# Altium project ADCAN_21_22_Project.PrjPcb (part 3 of 3)

## Sheet [4] Signals.SchDoc
size A4; SheetNumber: 5; SheetTotal: 6
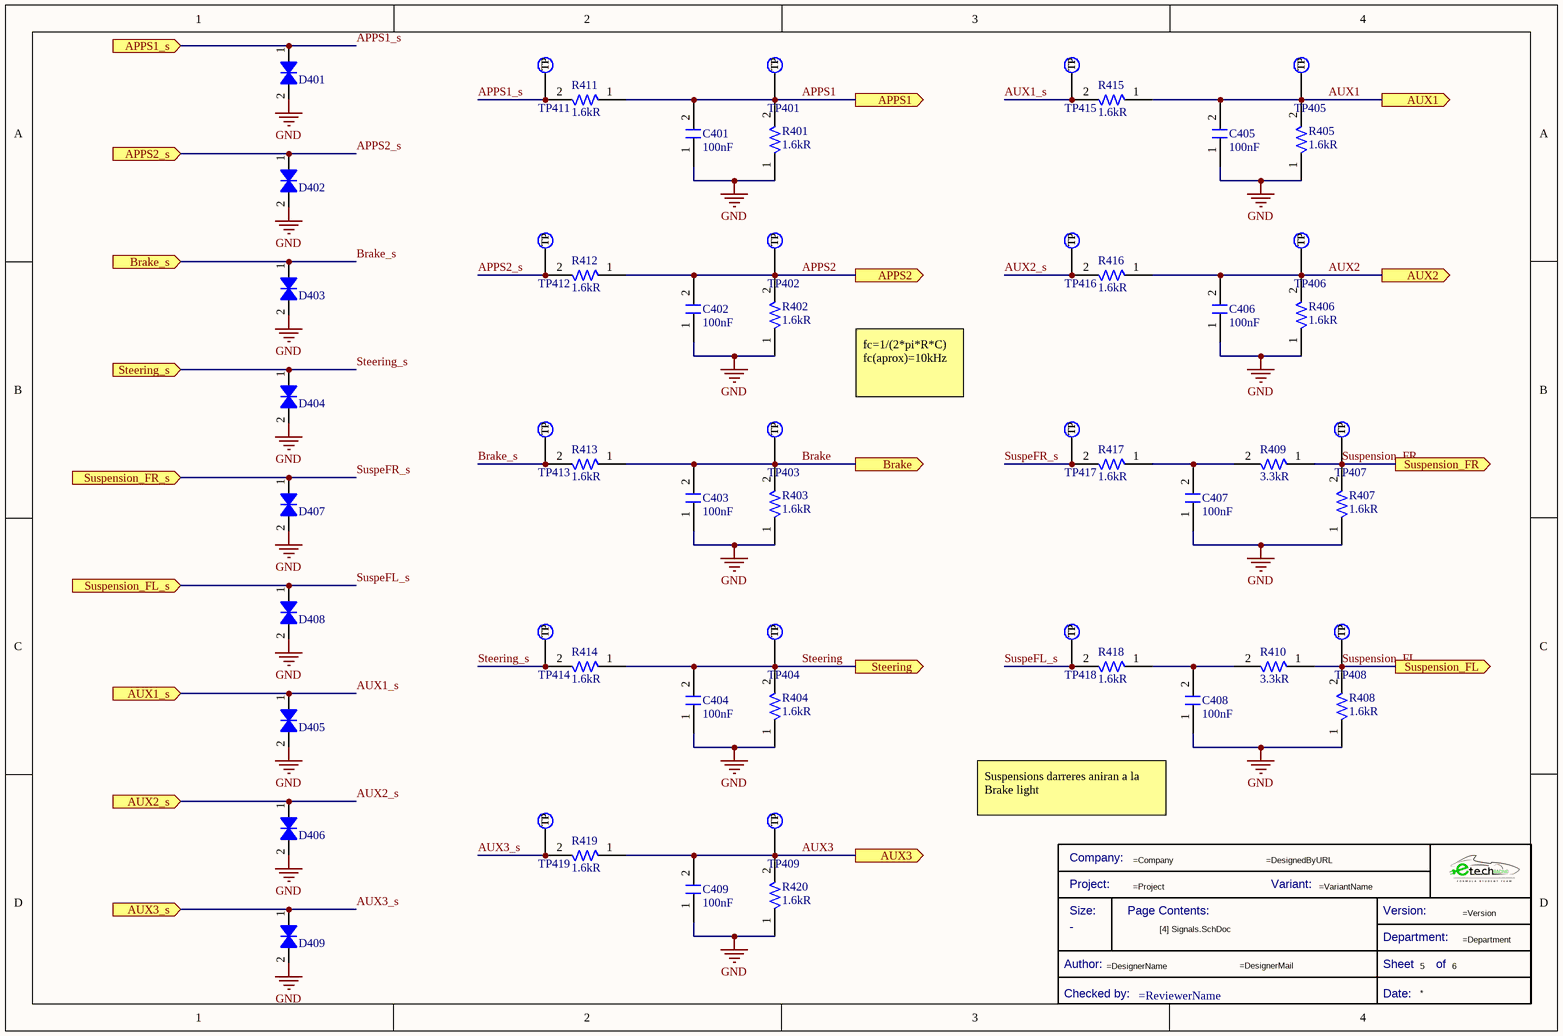
[diagram p4: [4] Signals.SchDoc]

### Parts
(Parts that share a designator on the sheet are numbered #1, #2 ... from top to bottom, then left to right.)
*#5  Title Block_template  (value not drawn)  (graphical)
C401  Capacitance: 100nF  [C1206FNPC-RW]  (hidden comment: 885012208009)
C402  Capacitance: 100nF  [C1206FNPC-RW]  (hidden comment: 885012208009)
C403  Capacitance: 100nF  [C1206FNPC-RW]  (hidden comment: 885012208009)
C404  Capacitance: 100nF  [C1206FNPC-RW]  (hidden comment: 885012208009)
C405  Capacitance: 100nF  [C1206FNPC-RW]  (hidden comment: 885012208009)
C406  Capacitance: 100nF  [C1206FNPC-RW]  (hidden comment: 885012208009)
C407  Capacitance: 100nF  [C1206FNPC-RW]  (hidden comment: 885012208009)
C408  Capacitance: 100nF  [C1206FNPC-RW]  (hidden comment: 885012208009)
C409  Capacitance: 100nF  [C1206FNPC-RW]  (hidden comment: 885012208009)
D401  824501600  [DTVS-DO-214AC]  (value not drawn)
D402  824501600  [DTVS-DO-214AC]  (value not drawn)
D403  824501600  [DTVS-DO-214AC]  (value not drawn)
D404  824501600  [DTVS-DO-214AC]  (value not drawn)
D405  824501600  [DTVS-DO-214AC]  (value not drawn)
D406  824501600  [DTVS-DO-214AC]  (value not drawn)
D407  824501600  [DTVS-DO-214AC]  (value not drawn)
D408  824501600  [DTVS-DO-214AC]  (value not drawn)
D409  824501600  [DTVS-DO-214AC]  (value not drawn)
R401  Resistance: 1.6kR  [R1206FTK-W]  (hidden comment: CRCW12061K60FKEA)
R402  Resistance: 1.6kR  [R1206FTK-W]  (hidden comment: CRCW12061K60FKEA)
R403  Resistance: 1.6kR  [R1206FTK-W]  (hidden comment: CRCW12061K60FKEA)
R404  Resistance: 1.6kR  [R1206FTK-W]  (hidden comment: CRCW12061K60FKEA)
R405  Resistance: 1.6kR  [R1206FTK-W]  (hidden comment: CRCW12061K60FKEA)
R406  Resistance: 1.6kR  [R1206FTK-W]  (hidden comment: CRCW12061K60FKEA)
R407  Resistance: 1.6kR  [R1206FTK-W]  (hidden comment: CRCW12064K30FKEA)
R408  Resistance: 1.6kR  [R1206FTK-W]  (hidden comment: CRCW12064K30FKEA)
R409  Resistance: 3.3kR  [R1206FTK-W]  (hidden comment: CRCW12066K19FKEA)
R410  Resistance: 3.3kR  [R1206FTK-W]  (hidden comment: CRCW12066K19FKEA)
R411  Resistance: 1.6kR  [R1206FTK-W]  (hidden comment: CRCW12061K60FKEA)
R412  Resistance: 1.6kR  [R1206FTK-W]  (hidden comment: CRCW12061K60FKEA)
R413  Resistance: 1.6kR  [R1206FTK-W]  (hidden comment: CRCW12061K60FKEA)
R414  Resistance: 1.6kR  [R1206FTK-W]  (hidden comment: CRCW12061K60FKEA)
R415  Resistance: 1.6kR  [R1206FTK-W]  (hidden comment: CRCW12061K60FKEA)
R416  Resistance: 1.6kR  [R1206FTK-W]  (hidden comment: CRCW12061K60FKEA)
R417  Resistance: 1.6kR  [R1206FTK-W]  (hidden comment: CRCW12061K60FKEA)
R418  Resistance: 1.6kR  [R1206FTK-W]  (hidden comment: CRCW12061K60FKEA)
R419  Resistance: 1.6kR  [R1206FTK-W]  (hidden comment: CRCW12061K60FKEA)
R420  Resistance: 1.6kR  [R1206FTK-W]  (hidden comment: CRCW12061K60FKEA)
TP401  TestPoint  [TestPoint]  (value not drawn)  (no BOM)
TP402  TestPoint  [TestPoint]  (value not drawn)  (no BOM)
TP403  TestPoint  [TestPoint]  (value not drawn)  (no BOM)
TP404  TestPoint  [TestPoint]  (value not drawn)  (no BOM)
TP405  TestPoint  [TestPoint]  (value not drawn)  (no BOM)
TP406  TestPoint  [TestPoint]  (value not drawn)  (no BOM)
TP407  TestPoint  [TestPoint]  (value not drawn)  (no BOM)
TP408  TestPoint  [TestPoint]  (value not drawn)  (no BOM)
TP409  TestPoint  [TestPoint]  (value not drawn)  (no BOM)
TP411  TestPoint  [TestPoint]  (value not drawn)  (no BOM)
TP412  TestPoint  [TestPoint]  (value not drawn)  (no BOM)
TP413  TestPoint  [TestPoint]  (value not drawn)  (no BOM)
TP414  TestPoint  [TestPoint]  (value not drawn)  (no BOM)
TP415  TestPoint  [TestPoint]  (value not drawn)  (no BOM)
TP416  TestPoint  [TestPoint]  (value not drawn)  (no BOM)
TP417  TestPoint  [TestPoint]  (value not drawn)  (no BOM)
TP418  TestPoint  [TestPoint]  (value not drawn)  (no BOM)
TP419  TestPoint  [TestPoint]  (value not drawn)  (no BOM)

### Ports
APPS1 (out), APPS1_s (in), APPS2 (out), APPS2_s (in), AUX1 (out), AUX1_s (in), AUX2 (out), AUX2_s (in), AUX3 (out), AUX3_s (in), Brake (out), Brake_s (in), Steering (out), Steering_s (in), Suspension_FL (out), Suspension_FL_s (in), Suspension_FR (out), Suspension_FR_s (in)

### Nets
GND: C401.1 C402.1 C403.1 C404.1 C405.1 C406.1 C407.1 C408.1 C409.1 D401.2 D402.2 D403.2 D404.2 D405.2 D406.2 D407.2 D408.2 D409.2 R401.1 R402.1 R403.1 R404.1 R405.1 R406.1 R407.1 R408.1 R420.1
APPS1: C401.2 R401.2 R411.1 TP401.1(TP) ; port APPS1
APPS1_s: D401.1 R411.2 TP411.1(TP) ; port APPS1_s
APPS2: C402.2 R402.2 R412.1 TP402.1(TP) ; port APPS2
APPS2_s: D402.1 R412.2 TP412.1(TP) ; port APPS2_s
AUX1: C405.2 R405.2 R415.1 TP405.1(TP) ; port AUX1
AUX1_s: D405.1 R415.2 TP415.1(TP) ; port AUX1_s
AUX2: C406.2 R406.2 R416.1 TP406.1(TP) ; port AUX2
AUX2_s: D406.1 R416.2 TP416.1(TP) ; port AUX2_s
AUX3: C409.2 R419.1 R420.2 TP409.1(TP) ; port AUX3
AUX3_s: D409.1 R419.2 TP419.1(TP) ; port AUX3_s
Brake: C403.2 R403.2 R413.1 TP403.1(TP) ; port Brake
Brake_s: D403.1 R413.2 TP413.1(TP) ; port Brake_s
Steering: C404.2 R404.2 R414.1 TP404.1(TP) ; port Steering
Steering_s: D404.1 R414.2 TP414.1(TP) ; port Steering_s
SuspeFL_s: D408.1 R418.2 TP418.1(TP) ; port Suspension_FL_s
SuspeFR_s: D407.1 R417.2 TP417.1(TP) ; port Suspension_FR_s
Suspension_FL: R408.2 R410.1 TP408.1(TP) ; port Suspension_FL
Suspension_FR: R407.2 R409.1 TP407.1(TP) ; port Suspension_FR
NetC407_2: C407.2 R409.2 R417.1
NetC408_2: C408.2 R410.2 R418.1

### Notes on the sheet
- fc=1/(2*pi*R*C)
  fc(aprox)=10kHz
- Suspensions darreres aniran a la Brake light
- (in symbol Title Block_template) Company:; Project:; Variant:; Size:; Page Contents:; Version:; Department:; Author:; Sheet; of; Checked by:; Date:

### Library data of the parts
*#5 = Title Block_template: Standard Title Block; .Creator: GP; Category: Title Block; .PCBcheck: GP; .SCHcheck: GP; Checked by:: =ReviewerName; Size: -
C401-C409 = C100n-10V-1206FNPC-X7R: Cap, 0.1ΜF, 10V, 10%, X7R, 1206; Manufacturer 1: Wurth Electronics; Supplier 1: Digi-Key; Manufacturer Part Number 1: 885012208009; RoHS: Yes; Category: Ceramic Capacitors; Stock 1: 7198; Pricing 1: 1=0,11000, 10=0,10300, 100=0,09200, 500=0,08100 (USD); Mount: Surface Mount; Case/Package: 1206; Case Code (Metric): 3216; Case Code (Imperial): 1206; Min Operating Temperature: -55°C; Max Operating Temperature: 125°C; Packaging: Tape and Reel; Voltage Rating: 10V; Tolerance: 10%; Length: 0.126inch; Width: 0.063inch; Thickness: 0.035inch; RoHS Compliant: Yes; ComponentLink1URL: http://www.farnell.com/datasheets/2031891.pdf?src-supplier=Farnell; ComponentLink1Description: http://www.farnell.com/datasheets/2031891.pdf?src-supplier=Farnell; ComponentLink2URL: http://katalog.we-online.de/pbs/datasheet/885012208009.pdf?src-supplier=Digi-Key; ComponentLink2Description: http://katalog.we-online.de/pbs/datasheet/885012208009.pdf?src-supplier=Digi-Key; ComponentLink3URL: https://katalog.we-online.de/pbs/datasheet/885012208009.pdf?src-supplier=Digi-Key; ComponentLink3Description: https://katalog.we-online.de/pbs/datasheet/885012208009.pdf?src-supplier=Digi-Key; Supplier Part Number 1: 732-8086-1-ND; ComponentLink4Description: Wurth Elektronik; ComponentLink4URL: https://www.we-online.com/catalog/en/WCAP-CSGP-10VDC?sq=885012208009#885012208009
D401-D409 = DTVS-6V-DO-214AC: TVS diode [Würth Elektronik] 824501600 TVS diode; Manufacturer: Wurth Electronics; Number of Bidirectional Channels: 1; Reverse Standoff Voltage: 6V; Min Breakdown Voltage: 7.02V; Clamping Voltage: 10.3V; Peak Pulse Power: 400W; Power Line Protection: No; Polarity: Bidirectional; Peak Pulse Current: 38.8A; ComponentLink1Description: Where buy it; ComponentLink1URL: https://www.we-online.com/catalog/en/WE-TVSP?sq=824501600#824501600; Supplier 1: Mouser; Manufacturer Part Number: 824501600; RoHS: Yes; Category: TVS Diodes; Stock 1: 780; Pricing 1: 1=0,28000, 10=0,26100, 50=0,26100, 100=0,23400, 500=0,20400, 1000=0,17400, 10000=0,17400 (USD); Mount: Surface Mount; Number of Pins: 2; Min Operating Temperature: -65°C; Max Operating Temperature: 150°C; Packaging: Cut Tape; Max Breakdown Voltage: 7.02V; Resistor Type: Zener; REACH SVHC: Unknown; RoHS Compliant: Yes; ComponentLink2URL: http://www.farnell.com/datasheets/2036401.pdf?src-supplier=Element14; ComponentLink2Description: http://www.farnell.com/datasheets/2036401.pdf?src-supplier=Element14; Supplier Part Number 1: 710-824501600; ComponentLink3URL: https://katalog.we-online.de/pbs/datasheet/824501600.pdf?src-supplier=Digi-Key; ComponentLink3Description: https://katalog.we-online.de/pbs/datasheet/824501600.pdf?src-supplier=Digi-Key
R401-R406 R411-R420 = R1.6K-1206FTK: Res Thick Film 1206 1.6K Ohm 1% 1/4W ±100ppm/°C Molded SMD SMD Paper T/R; Manufacturer 1: Vishay; Max Power Dissipation: 250mW; Voltage Rating: 200V; Supplier 1: Digi-Key; Manufacturer Part Number 1: CRCW12061K60FKEA; RoHS: Yes; Category: Chip SMD Resistors; Pricing 1: 1=0,10000, 10=0,08200, 100=0,03160, 1000=0,01392, 2500=0,01202 (USD); Case/Package: 1206; Number of Pins: 2; Contact Plating: Tin; Case Code (Metric): 3216; Case Code (Imperial): 1206; Weight: 0.000353oz; Size Code: 1206; Min Operating Temperature: -55°C; Max Operating Temperature: 155°C; Tolerance: 1%; Resistor Type: Thick Film; Temperature Coefficient: 100ppm/°C; Package Quantity: 5000; Packaging: Tape and Reel; Number of Terminations: 2; Features: Automotive AEC-Q200; Series: CRCW; Power Rating: 250mW; Termination: SMD/SMT; Voltage Rating (DC): 200V; Resistance Tolerance: 1%; Technology: THICK FILM; Construction: Rectangular; Length: 3.2mm; Width: 0.063inch; Height: 0.55mm; Depth: 1.6mm; Radiation Hardening: No; Lead Free: Lead Free; RoHS Compliant: Yes; REACH SVHC: Unknown; Military Standard: Not; ComponentLink1URL: https://datasheet.ciiva.com/11811/0900766b80d98b5e-11811377.pdf?src-supplier=RSComponents; ComponentLink1Description: https://datasheet.ciiva.com/11811/0900766b80d98b5e-11811377.pdf?src-supplier=RSComponents; ComponentLink2URL: https://datasheet.ciiva.com/2515/dcrcwe3-2515616.pdf?src-supplier=Digi-Key; ComponentLink2Description: https://datasheet.ciiva.com/2515/dcrcwe3-2515616.pdf?src-supplier=Digi-Key; ComponentLink3URL: https://datasheet.ciiva.com/2515/dcrcwe3-2515617.pdf?src-supplier=Digi-Key; ComponentLink3Description: https://datasheet.ciiva.com/2515/dcrcwe3-2515617.pdf?src-supplier=Digi-Key; ComponentLink4URL: https://datasheet.ciiva.com/2515/dcrcwe3-2515618.pdf?src-supplier=Digi-Key; ComponentLink4Description: https://datasheet.ciiva.com/2515/dcrcwe3-2515618.pdf?src-supplier=Digi-Key; ComponentLink5URL: https://datasheet.ciiva.com/9098/dcrcwe3-9098889.pdf?src-supplier=Avnet; ComponentLink5Description: https://datasheet.ciiva.com/9098/dcrcwe3-9098889.pdf?src-supplier=Avnet; ComponentLink6URL: https://datasheet.ciiva.com/16213/dcrcwe3-16213498.pdf?src-supplier=Future+Electronics; ComponentLink6Description: https://datasheet.ciiva.com/16213/dcrcwe3-16213498.pdf?src-supplier=Future+Electronics; ComponentLink7URL: https://datasheet.ciiva.com/17203/dcrcwe3-17203786.pdf?src-supplier=Avnet+Europe; ComponentLink7Description: https://datasheet.ciiva.com/17203/dcrcwe3-17203786.pdf?src-supplier=Avnet+Europe; ComponentLink8URL: https://datasheet.ciiva.com/7670/1697337-7670316.pdf?src-supplier=Element14; ComponentLink8Description: https://datasheet.ciiva.com/7670/1697337-7670316.pdf?src-supplier=Element14; ComponentLink9URL: https://datasheet.ciiva.com/7670/1697337-7670317.pdf?src-supplier=Element14; ComponentLink9Description: https://datasheet.ciiva.com/7670/1697337-7670317.pdf?src-supplier=Element14; ComponentLink10URL: https://datasheet.ciiva.com/5550/dcrcwe3-109170-5550718.pdf?src-supplier=Mouser; ComponentLink10Description: https://datasheet.ciiva.com/5550/dcrcwe3-109170-5550718.pdf?src-supplier=Mouser; Supplier Part Number 1: 541-1.60KFCT-ND; ComponentLink11Description: RS; ComponentLink11URL: https://es.rs-online.com/web/p/resistencias-fijas-para-montaje-en-superficie/6791866/
R407 R408 = R4.3K-1206FTK: Res Thick Film 1206 4.3K Ohm 1% 1/4W ±100ppm/°C Molded SMD SMD Paper T/R; Manufacturer 1: Vishay; Power Rating: 250mW; Voltage Rating: 200V; Supplier 1: Digi-Key; Manufacturer Part Number 1: CRCW12064K30FKEA; RoHS: Yes; Category: Chip SMD Resistors; Pricing 1: 1=0,10000, 10=0,08200, 100=0,03160, 1000=0,01392, 2500=0,01202 (USD); Case/Package: 1206; Number of Pins: 2; Contact Plating: Tin; Weight: 0.000353oz; Case Code (Metric): 3216; Case Code (Imperial): 1206; Min Operating Temperature: -55°C; Max Operating Temperature: 155°C; Tolerance: 1%; Resistor Type: Thick Film; Temperature Coefficient: 100ppm/°C; Packaging: Tape and Reel; Number of Terminations: 2; Termination: SMD/SMT; Max Power Dissipation: 250mW; Features: Automotive AEC-Q200; Series: CRCW; Package Quantity: 10; Voltage Rating (DC): 200V; Resistance Tolerance: 1%; Construction: Rectangular; Technology: THICK FILM; Length: 3.2mm; Width: 0.063inch; Height: 0.55mm; Depth: 1.6mm; Radiation Hardening: No; Lead Free: Lead Free; RoHS Compliant: Yes; REACH SVHC: Unknown; Military Standard: Not; ComponentLink1URL: https://datasheet.ciiva.com/11811/0900766b80d98b5e-11811783.pdf?src-supplier=RSComponents; ComponentLink1Description: https://datasheet.ciiva.com/11811/0900766b80d98b5e-11811783.pdf?src-supplier=RSComponents; ComponentLink2URL: https://datasheet.ciiva.com/2497/dcrcwe3-2497360.pdf?src-supplier=Digi-Key; ComponentLink2Description: https://datasheet.ciiva.com/2497/dcrcwe3-2497360.pdf?src-supplier=Digi-Key; ComponentLink3URL: https://datasheet.ciiva.com/2497/dcrcwe3-2497361.pdf?src-supplier=Digi-Key; ComponentLink3Description: https://datasheet.ciiva.com/2497/dcrcwe3-2497361.pdf?src-supplier=Digi-Key; ComponentLink4URL: https://datasheet.ciiva.com/2497/dcrcwe3-2497362.pdf?src-supplier=Digi-Key; ComponentLink4Description: https://datasheet.ciiva.com/2497/dcrcwe3-2497362.pdf?src-supplier=Digi-Key; ComponentLink5URL: https://datasheet.ciiva.com/7679/1533075-7679286.pdf?src-supplier=Element14; ComponentLink5Description: https://datasheet.ciiva.com/7679/1533075-7679286.pdf?src-supplier=Element14; ComponentLink6URL: https://datasheet.ciiva.com/5562/dcrcwe3-109170-5562219.pdf?src-supplier=Mouser; ComponentLink6Description: https://datasheet.ciiva.com/5562/dcrcwe3-109170-5562219.pdf?src-supplier=Mouser; ComponentLink7URL: https://datasheet.ciiva.com/17196/dcrcwe3-17196843.pdf?src-supplier=Avnet+Europe; ComponentLink7Description: https://datasheet.ciiva.com/17196/dcrcwe3-17196843.pdf?src-supplier=Avnet+Europe; ComponentLink8URL: https://datasheet.ciiva.com/7679/1697337-7679213.pdf?src-supplier=Element14; ComponentLink8Description: https://datasheet.ciiva.com/7679/1697337-7679213.pdf?src-supplier=Element14; ComponentLink9URL: https://datasheet.ciiva.com/9073/dcrcwe3-9073935.pdf?src-supplier=Avnet; ComponentLink9Description: https://datasheet.ciiva.com/9073/dcrcwe3-9073935.pdf?src-supplier=Avnet; Supplier Part Number 1: 541-4.30KFCT-ND; ComponentLink10Description: RS; ComponentLink10URL: https://es.rs-online.com/web/p/resistencias-fijas-para-montaje-en-superficie/6792187/
R409 R410 = R6.2K-1206FTK: Res Thick Film 1206 6.19K Ohm 1% 1/4W ±100ppm/°C Molded SMD SMD Paper T/R; Manufacturer 1: Vishay; Power Rating: 250mW; Voltage Rating: 200V; Supplier 1: Digi-Key; Manufacturer Part Number 1: CRCW12066K19FKEA; RoHS: Yes; Category: Chip SMD Resistors; Stock 1: 66; Pricing 1: 1=0,10000, 10=0,08200, 100=0,03160, 1000=0,01392, 2500=0,01202 (USD); Case/Package: 1206; Contact Plating: Tin; Weight: 0.000353oz; Case Code (Imperial): 1206; Case Code (Metric): 3216; Min Operating Temperature: -55°C; Max Operating Temperature: 155°C; Tolerance: 1%; Temperature Coefficient: 100ppm/°C; Packaging: Tape and Reel; Resistor Type: Thick Film; Number of Terminations: 2; Max Power Dissipation: 250mW; Features: Automotive AEC-Q200; Series: CRCW; Package Quantity: 10; Termination: SMD/SMT; Voltage Rating (DC): 200V; Resistance Tolerance: 1%; Technology: THICK FILM; Construction: Rectangular; Length: 3.2mm; Width: 1.6mm; Height: 0.55mm; Depth: 1.6mm; Radiation Hardening: No; Lead Free: Lead Free; RoHS Compliant: Yes; REACH SVHC: Unknown; Military Standard: Not; ComponentLink1URL: https://datasheet.ciiva.com/11818/0900766b80d98b5e-11818251.pdf?src-supplier=RSComponents; ComponentLink1Description: https://datasheet.ciiva.com/11818/0900766b80d98b5e-11818251.pdf?src-supplier=RSComponents; ComponentLink2URL: https://datasheet.ciiva.com/17193/dcrcwe3-17193575.pdf?src-supplier=Avnet+Europe; ComponentLink2Description: https://datasheet.ciiva.com/17193/dcrcwe3-17193575.pdf?src-supplier=Avnet+Europe; ComponentLink3URL: https://datasheet.ciiva.com/2496/dcrcwe3-2496955.pdf?src-supplier=Digi-Key; ComponentLink3Description: https://datasheet.ciiva.com/2496/dcrcwe3-2496955.pdf?src-supplier=Digi-Key; ComponentLink4URL: https://datasheet.ciiva.com/2496/dcrcwe3-2496956.pdf?src-supplier=Digi-Key; ComponentLink4Description: https://datasheet.ciiva.com/2496/dcrcwe3-2496956.pdf?src-supplier=Digi-Key; ComponentLink5URL: https://datasheet.ciiva.com/16201/dcrcwe3-16201468.pdf?src-supplier=Future+Electronics; ComponentLink5Description: https://datasheet.ciiva.com/16201/dcrcwe3-16201468.pdf?src-supplier=Future+Electronics; ComponentLink6URL: https://datasheet.ciiva.com/2496/dcrcwe3-2496957.pdf?src-supplier=Digi-Key; ComponentLink6Description: https://datasheet.ciiva.com/2496/dcrcwe3-2496957.pdf?src-supplier=Digi-Key; Supplier Part Number 1: 541-6.19KFCT-ND; ComponentLink7Description: RS; ComponentLink7URL: https://es.rs-online.com/web/p/resistencias-fijas-para-montaje-en-superficie/6792291/
TP401-TP409 TP411-TP419 = TestPoint: Test Point 1x1 mm; Category: TestPoint

## Sheet [5] Accelerometer.SchDoc
size A4; SheetNumber: 6; SheetTotal: 6
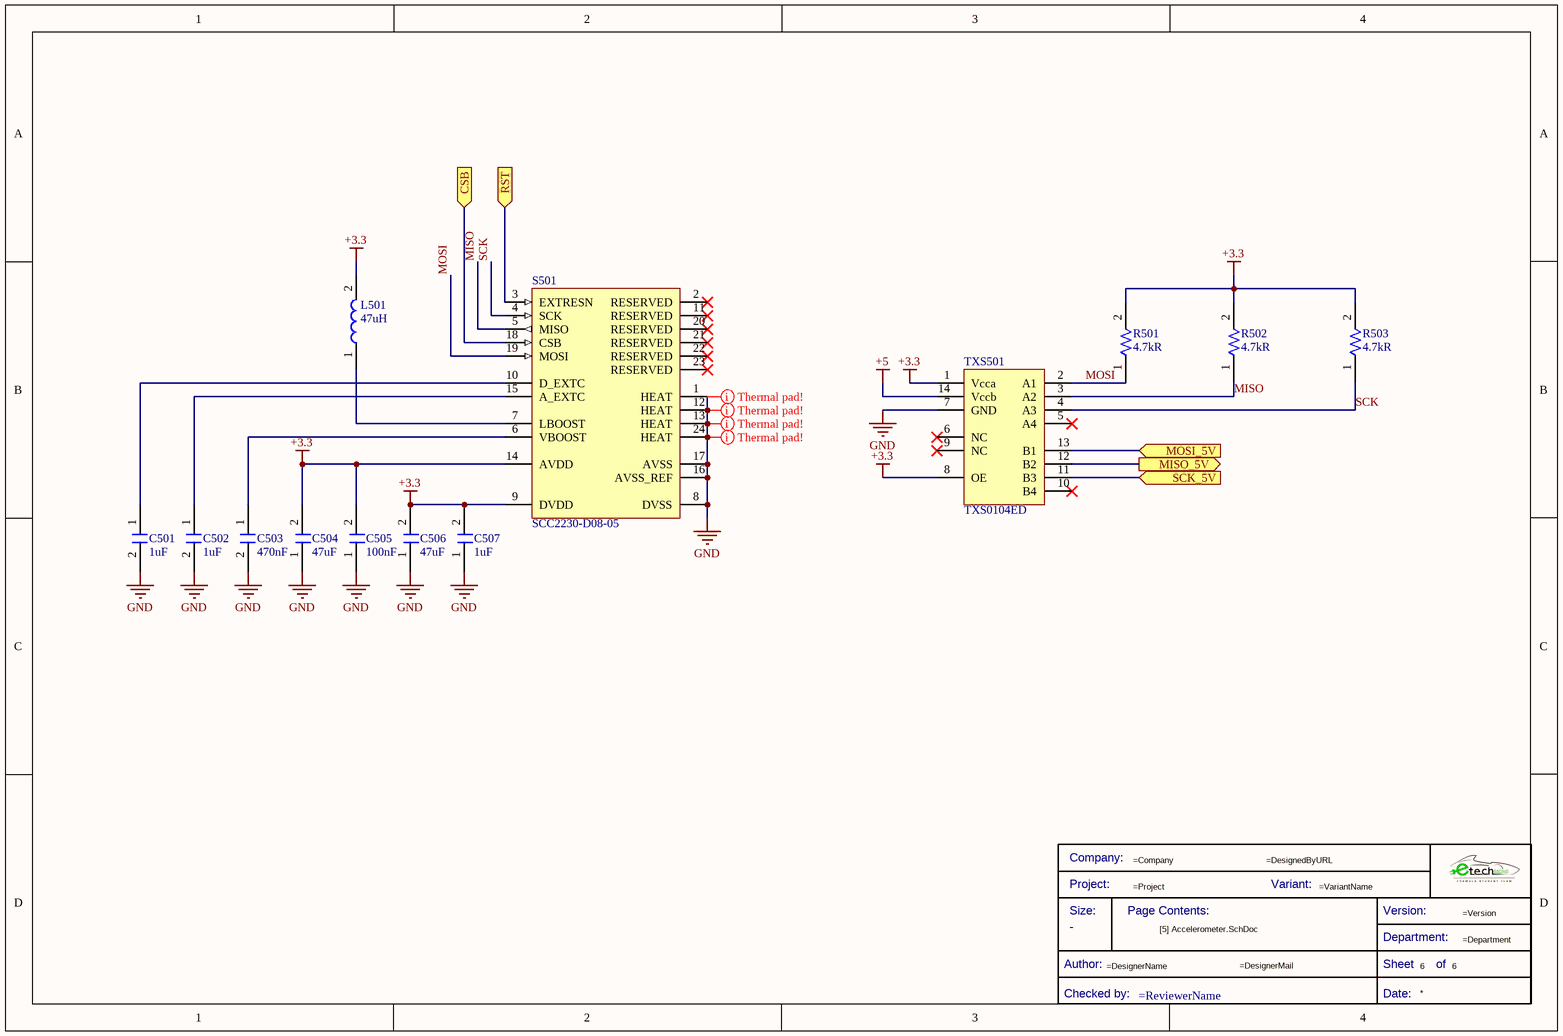
[diagram p5: [5] Accelerometer.SchDoc]

### Parts
(Parts that share a designator on the sheet are numbered #1, #2 ... from top to bottom, then left to right.)
*#6  Title Block_template  (value not drawn)  (graphical)
C501  Capacitance: 1uF  [C1206FNPC-RW]  (hidden comment: 885012208036)
C502  Capacitance: 1uF  [C1206FNPC-RW]  (hidden comment: 885012208036)
C503  Capacitance: 470nF  [C1206FNPC-RW]  (hidden comment: 885012208011)
C504  Capacitance: 47uF  [C1206FNPC-RW]  (hidden comment: 885012108012)
C505  Capacitance: 100nF  [C1206FNPC-RW]  (hidden comment: 885012208009)
C506  Capacitance: 47uF  [C1206FNPC-RW]  (hidden comment: 885012108012)
C507  Capacitance: 1uF  [C1206FNPC-RW]  (hidden comment: 885012208036)
L501  Inductance: 47uH  [L47u-60mA_CF]  (hidden comment: 744764147)
R501  Resistance: 4.7kR  [R1206FTK-W]  (hidden comment: CRS1206-FX-4701ELF)
R502  Resistance: 4.7kR  [R1206FTK-W]  (hidden comment: CRS1206-FX-4701ELF)
R503  Resistance: 4.7kR  [R1206FTK-W]  (hidden comment: CRS1206-FX-4701ELF)
S501  Manufacturer Part Number 1: SCC2230-D08-05  [Accel_SCC2230-D08]  (hidden comment: SCC2230-D08)
TXS501  Manufacturer Part Number 1: TXS0104ED  [4bitBVL_TXS0104E]  (hidden comment: TXS0104E)

### Ports
CSB (in), MISO_5V (out), MOSI_5V (in), RST (in), SCK_5V (in)

### Nets
+3.3: C504.2 C505.2 C506.2 C507.2 L501.2 R501.2 R502.2 R503.2 S501.9(DVDD) S501.14(AVDD) TXS501.1(Vcca) TXS501.8(OE)
+5: TXS501.14(Vccb)
GND: C501.2 C502.2 C503.2 C504.1 C505.1 C506.1 C507.1 S501.1(HEAT) S501.8(DVSS) S501.12(HEAT) S501.13(HEAT) S501.16(AVSS_REF) S501.17(AVSS) S501.24(HEAT) TXS501.7(GND)
CSB: S501.18(CSB) ; port CSB
MISO: R502.1 S501.5(MISO) TXS501.3(A2)
MISO_5V: TXS501.12(B2) ; port MISO_5V
MOSI: R501.1 S501.19(MOSI) TXS501.2(A1)
MOSI_5V: TXS501.13(B1) ; port MOSI_5V
RST: S501.3(EXTRESN) ; port RST
SCK: R503.1 S501.4(SCK) TXS501.4(A3)
SCK_5V: TXS501.11(B3) ; port SCK_5V
NetC501_1: C501.1 S501.10(D_EXTC)
NetC502_1: C502.1 S501.15(A_EXTC)
NetC503_1: C503.1 S501.6(VBOOST)
NetL501_1: L501.1 S501.7(LBOOST)

Not connected (* = marked no-connect by the designer): S501 2(RESERVED)* 11(RESERVED)* 20(RESERVED)* 21(RESERVED)* 22(RESERVED)* 23(RESERVED)*; TXS501 5(A4)* 6(NC)* 9(NC)* 10(B4)*

### Layout directives
mark named Thermal pad!: GND

### Notes on the sheet
- (in symbol Title Block_template) Company:; Project:; Variant:; Size:; Page Contents:; Version:; Department:; Author:; Sheet; of; Checked by:; Date:

### Library data of the parts
*#6 = Title Block_template: Standard Title Block; .Creator: GP; Category: Title Block; .PCBcheck: GP; .SCHcheck: GP; Checked by:: =ReviewerName; Size: -
C501 C502 C507 = C1u-16V-1206FNPC-X7R: Cap Cer 1UF 16V X7R 1206; Manufacturer: Wurth Electronics; Tolerance: 10%; Category: Capacitor; ComponentLink1Description: Datasheet; ComponentLink1URL: https://www.we-online.com/catalog/datasheet/885012208036.pdf; ComponentLink2Description: Where buy it; ComponentLink2URL: https://www.we-online.com/catalog/en/WCAP-CSGP-16VDC#885012208036; Supplier 1: Mouser; Manufacturer Part Number: 885012208036; RoHS: Yes; Stock 1: 5938; Pricing 1: 1=0,15000, 10=0,13900, 50=0,13900, 100=0,12400, 500=0,11000, 1000=0,11000, 3000=0,09100, 10000=0,09100 (USD); Mount: Surface Mount; Case/Package: 1206; Case Code (Metric): 3216; Case Code (Imperial): 1206; Min Operating Temperature: -55°C; Max Operating Temperature: 125°C; Packaging: Tape and Reel; Voltage Rating: 16V; Length: 0.126inch; Width: 0.063inch; Thickness: 0.051inch; RoHS Compliant: Yes; Supplier Part Number 1: 710-885012208036
C503 = C470n-10V-1206FNPC-X7R: Cap, 0.47ΜF, 10V, 10%, X7R, 1206; Manufacturer 1: Wurth Electronics; Supplier 1: Digi-Key; Manufacturer Part Number 1: 885012208011; RoHS: Yes; Category: Ceramic Capacitors; Stock 1: 1142; Pricing 1: 1=0,20000, 10=0,17700, 100=0,15900, 500=0,14000 (USD); Mount: Surface Mount; Case/Package: 1206; Case Code (Metric): 3216; Case Code (Imperial): 1206; Min Operating Temperature: -55°C; Max Operating Temperature: 125°C; Packaging: Tape and Reel; Voltage Rating: 10V; Tolerance: 10%; Length: 0.126inch; Width: 0.063inch; Thickness: 0.051inch; RoHS Compliant: Yes; ComponentLink1URL: http://www.farnell.com/datasheets/2546926.pdf?src-supplier=Farnell; ComponentLink1Description: http://www.farnell.com/datasheets/2546926.pdf?src-supplier=Farnell; ComponentLink2URL: https://katalog.we-online.de/pbs/datasheet/885012208011.pdf?src-supplier=Digi-Key; ComponentLink2Description: https://katalog.we-online.de/pbs/datasheet/885012208011.pdf?src-supplier=Digi-Key; Supplier Part Number 1: 732-7683-1-ND; ComponentLink3Description: Wurth Elektronik; ComponentLink3URL: https://www.we-online.com/catalog/en/WCAP-CSGP-10VDC?sq=885012208011#885012208011
C504 C506 = C47u-10V-1206FNPC-X5R: Multilayer Ceramic Capacitor, Wcap-Csgp Series, 47 F, 20%, X5r, 10 V, 1206 [3216 Metric]; Manufacturer 1: Wurth Electronics; Voltage Rating: 10V; Supplier 1: Digi-Key; Manufacturer Part Number 1: 885012108012; RoHS: Yes; Category: Ceramic Capacitors; Stock 1: 2003; Pricing 1: 1=1,26000, 10=1,14000, 100=1,02200, 500=0,90400 (USD); Mount: Surface Mount; Case/Package: 1206; Case Code (Metric): 3216; Case Code (Imperial): 1206; Min Operating Temperature: -55°C; Max Operating Temperature: 85°C; Packaging: Cut Tape; Dielectric: X5R; Tolerance: 20%; Voltage Rating (DC): 10V; Length: 0.126inch; Width: 0.063inch; Thickness: 0.075inch; REACH SVHC: Unknown; RoHS Compliant: Yes; ComponentLink1URL: http://www.farnell.com/datasheets/1958457.pdf?src-supplier=Farnell; ComponentLink1Description: http://www.farnell.com/datasheets/1958457.pdf?src-supplier=Farnell; ComponentLink2URL: https://katalog.we-online.de/pbs/datasheet/885012108012.pdf?src-supplier=Digi-Key; ComponentLink2Description: https://katalog.we-online.de/pbs/datasheet/885012108012.pdf?src-supplier=Digi-Key; ComponentLink3URL: http://www.farnell.com/datasheets/1958457.pdf?src-supplier=Element14; ComponentLink3Description: http://www.farnell.com/datasheets/1958457.pdf?src-supplier=Element14; Supplier Part Number 1: 732-7638-1-ND; ComponentLink4Description: Wurth Elektronik; ComponentLink4URL: https://www.we-online.com/catalog/en/WCAP-CSGP-10VDC?sq=885012108012#885012108012
C505 = C100n-10V-1206FNPC-X7R: as C401 on sheet [4] Signals; Supplier 1: Digi-Key; Manufacturer Part Number 1: 885012208009; RoHS: Yes; Category: Ceramic Capacitors; Stock 1: 7198; Pricing 1: 1=0,11000, 10=0,10300, 100=0,09200, 500=0,08100 (USD); Mount: Surface Mount; Case/Package: 1206; Case Code (Metric): 3216; Case Code (Imperial): 1206; Min Operating Temperature: -55°C; Max Operating Temperature: 125°C; Packaging: Tape and Reel; Voltage Rating: 10V; Tolerance: 10%; Length: 0.126inch; Width: 0.063inch; Thickness: 0.035inch; RoHS Compliant: Yes; ComponentLink1URL: http://www.farnell.com/datasheets/2031891.pdf?src-supplier=Farnell; ComponentLink1Description: http://www.farnell.com/datasheets/2031891.pdf?src-supplier=Farnell; ComponentLink2URL: http://katalog.we-online.de/pbs/datasheet/885012208009.pdf?src-supplier=Digi-Key; ComponentLink2Description: http://katalog.we-online.de/pbs/datasheet/885012208009.pdf?src-supplier=Digi-Key; ComponentLink3URL: https://katalog.we-online.de/pbs/datasheet/885012208009.pdf?src-supplier=Digi-Key; ComponentLink3Description: https://katalog.we-online.de/pbs/datasheet/885012208009.pdf?src-supplier=Digi-Key; Supplier Part Number 1: 732-8086-1-ND; ComponentLink4Description: Wurth Elektronik; ComponentLink4URL: https://www.we-online.com/catalog/en/WCAP-CSGP-10VDC?sq=885012208009#885012208009
L501 = L47u-60mA_CF: WE-GF Series; Wire-wound SMD Inductor with Ferrite Core; 47 µH; Manufacturer 1: Wurth Electronics; Tolerance: 10%; Max DC Current: 60mA; DC Resistance (DCR): 7R; Self Resonant Frequency: 15MHz; Supplier 1: Digi-Key; Manufacturer Part Number 1: 744764147; RoHS: Yes; Category: Fixed Inductors; Stock 1: 156; Pricing 1: 1=0,66000, 10=0,59500, 50=0,54800, 100=0,51200, 500=0,46500 (USD); Mount: Surface Mount; Case/Package: 1210; Core Material: Ferrite; Min Operating Temperature: -40°C; Max Operating Temperature: 105°C; Packaging: Cut Tape; Inductance Tolerance: 10%; Series: WE-GF; Length: 3.2mm; Height: 2.2mm; Depth: 2.5mm; REACH SVHC: Unknown; RoHS Compliant: Yes; ComponentLink1URL: https://datasheet.ciiva.com/11801/0900766b802e95df-11801953.pdf?src-supplier=RSComponents; ComponentLink1Description: https://datasheet.ciiva.com/11801/0900766b802e95df-11801953.pdf?src-supplier=RSComponents; Supplier Part Number 1: 732-14034-1-ND; ComponentLink2Description: Wurth Elektronik; ComponentLink2URL: https://www.we-online.com/catalog/en/WE-GF?sq=744764147&sp=https%3A%2F%2Fwww.we-online.com%2Fweb%2Fen%2Fwuerth_elektronik%2Fsearchpage.php%3Fsearch%3D744764147#744764147
R501-R503 = R4.7K-1206FTK: as 206 on sheet [2] MCU; Supplier 1: Digi-Key; RoHS: Yes; Category: Chip SMD Resistors; Pricing 1: 1=0,42000, 10=0,35400, 100=0,13850, 1000=0,05796, 2500=0,05313 (USD); Mount: Surface Mount; Case/Package: 1206; Case Code (Metric): 3016; Case Code (Imperial): 1206; Min Operating Temperature: -55°C; Max Operating Temperature: 155°C; Packaging: Cut Tape; Resistor Type: Thick Film; Number of Terminations: 2; Termination: SMD/SMT; Working Voltage: 400V; Voltage Rating (DC): 400V; Tolerance: 1%; Max Power Dissipation: 500mW; Temperature Coefficient: 100ppm/°C; Length: 0.122inch; Width: 0.063inch; Height: 0.026inch; REACH SVHC: No SVHC; ComponentLink1URL: https://datasheet.ciiva.com/48986/70483705-48986735.pdf?src-supplier=Allied+Electronics; ComponentLink1Description: https://datasheet.ciiva.com/48986/70483705-48986735.pdf?src-supplier=Allied+Electronics; Supplier Part Number 1: CRS1206-FX-4701ELFCT-ND; ComponentLink3Description: RS; ComponentLink3URL: https://es.rs-online.com/web/p/resistencias-de-montaje-en-superficie/8672965; Manufacturer Part Number 1: CRS1206-FX-4701ELF
S501 = Accel_SCC2230-D08: Accelerometer and Gyroscope Digital Output 3.3V 24-Pin SOIC T/R; Manufacturer 1: Murata; Sensor Type: Accelerometer,Gyroscope,3 Axis; Output Type: SPI; Supplier 1: Digi-Key; RoHS: Yes; Category: Inertial Measurement Units (IMUs); Stock 1: 296; Pricing 1: 1=92,29000, 5=87,67600, 10=80,75400, 25=71,52480 (USD); Mount: Surface Mount; Case/Package: SMD/SMT; Min Operating Temperature: -40°C; Max Operating Temperature: 125°C; Packaging: Tape and Reel; RoHS Compliant: Yes; ComponentLink1URL: https://www.murata.com/~/media/webrenewal/products/sensor/gyro/scc2000/scc2230-d08%20datasheet%2082177600b0.ashx?la=en&src-supplier=Digi-Key; ComponentLink1Description: https://www.murata.com/~/media/webrenewal/products/sensor/gyro/scc2000/scc2230-d08%20datasheet%2082177600b0.ashx?la=en&src-supplier=Digi-Key; Supplier Part Number 1: 490-12142-1-ND; ComponentLink2Description: Murata; ComponentLink2URL: https://www.murata.com/en-global/products/productdetail?partno=SCC2230-D08
TXS501 = 4bitBVL_TXS0104E: 4-Bit Bidirectional Voltage-Level Shifter for Open-Drain and Push-Pull Applications 14-SOIC -40 to 85; Manufacturer 1: Texas Instruments; Data Rate: 24Mbps; Number of Channels: 4; Propagation Delay: 260ns; Min Supply Voltage: 1.65V; Max Supply Voltage: 5.5V; Logic Function: Translator; High Level Output Current: -20uA; Low Level Output Current: 1mA; Quiescent Current: 14.4uA; Nominal Supply Current: 12uA; Number of Circuits: 1; Supplier 1: Digi-Key; RoHS: Yes; Category: Voltage Level Shifters; Stock 1: 9570; Pricing 1: 1=1,54000, 10=1,37600, 25=1,30600, 100=1,07270, 250=1,00276, 500=0,88616, 1000=0,77000 (USD); Mount: Surface Mount; Case/Package: SOIC; Number of Pins: 14; Weight: 0.004564oz; Min Operating Temperature: -40°C; Max Operating Temperature: 85°C; Packaging: Rail/Tube; Package Quantity: 50; Number of Bits: 4; Turn-On Delay Time: 260ns; Output Type: Voltage; Series: -; Number of Inputs: 4; Output Current: 1mA; Length: 8.65mm; Width: 3.91mm; Height: 1.58mm; Radiation Hardening: No; Lead Free: Lead Free; RoHS Compliant: Yes; REACH SVHC: No SVHC; ComponentLink1URL: https://datasheet.ciiva.com/1628/txs0104e-1628720.pdf?src-supplier=Newark; ComponentLink1Description: https://datasheet.ciiva.com/1628/txs0104e-1628720.pdf?src-supplier=Newark; ComponentLink2URL: https://datasheet.ciiva.com/15096/getdatasheetpartid-226007-15096240.pdf?src-supplier=Verical; ComponentLink2Description: https://datasheet.ciiva.com/15096/getdatasheetpartid-226007-15096240.pdf?src-supplier=Verical; ComponentLink3URL: https://datasheet.ciiva.com/41455/001017332-da-01-en-ic-4bit-transltr-txs0104ed-soic-14-tid-41455684.pdf?src-supplier=Conrad; ComponentLink3Description: https://datasheet.ciiva.com/41455/001017332-da-01-en-ic-4bit-transltr-txs0104ed-soic-14-tid-41455684.pdf?src-supplier=Conrad; ComponentLink4URL: https://datasheet.ciiva.com/1508/1811230-1508823.pdf?src-supplier=Element14; ComponentLink4Description: https://datasheet.ciiva.com/1508/1811230-1508823.pdf?src-supplier=Element14; ComponentLink5URL: https://datasheet.ciiva.com/6615/txs0104e-6615001.pdf?src-supplier=Digi-Key; ComponentLink5Description: https://datasheet.ciiva.com/6615/txs0104e-6615001.pdf?src-supplier=Digi-Key; Supplier Part Number 1: 296-34699-5-ND; ComponentLink6Description: RS uk; ComponentLink6URL: https://uk.rs-online.com/web/p/translator-ics/9236848

## Sheet [6] ADC.SchDoc
size A4
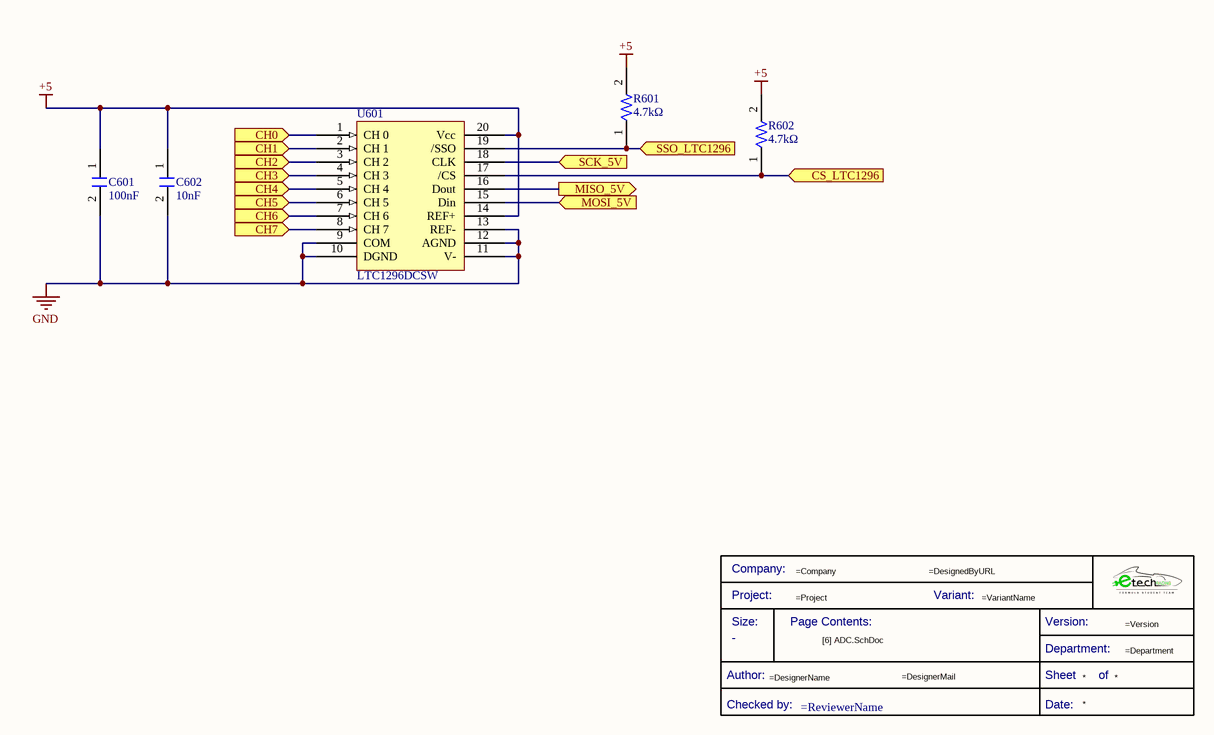
[diagram p6: [6] ADC.SchDoc]

### Parts
(Parts that share a designator on the sheet are numbered #1, #2 ... from top to bottom, then left to right.)
*#7  Title Block_template  (value not drawn)  (graphical)
C601  Capacitance: 100nF  [C1206FNPC-RW]  (hidden comment: 885012208009)
C602  Capacitance: 10nF  [C1206FNPC-RW]  (hidden comment: 885012208009)
R601  Resistance: 4.7kΩ  [R1206FTK-W]  (hidden comment: CRS1206-FX-4701ELF)
R602  Resistance: 4.7kΩ  [R1206FTK-W]  (hidden comment: CRS1206-FX-4701ELF)
U601  Manufacturer Part Number 1: LTC1296DCSW  [ADC_LTC1296]  (hidden comment: LTC1296)

### Ports
CH0 (in), CH1 (in), CH2 (in), CH3 (in), CH4 (in), CH5 (in), CH6 (in), CH7 (in), CS_LTC1296 (in), MISO_5V (out), MOSI_5V (in), SCK_5V (in), SSO_LTC1296 (in)

### Nets
+5: C601.1 C602.1 R601.2 R602.2 U601.14(REF+) U601.20(Vcc)
GND: C601.2 C602.2 U601.9(COM) U601.10(DGND) U601.11(V-) U601.12(AGND) U601.13(REF-)
CS_LTC1296: R602.1 U601.17(/CS) ; port CS_LTC1296
MISO_5V: U601.16(Dout) ; port MISO_5V
MOSI_5V: U601.15(Din) ; port MOSI_5V
SCK_5V: U601.18(CLK) ; port SCK_5V
SSO_LTC1296: R601.1 U601.19(/SSO) ; port SSO_LTC1296
NetJ2_1: U601.7(CH_6) ; port CH6
NetJ2_2: U601.8(CH_7) ; port CH7
NetJ2_3: U601.1(CH_0) ; port CH0
NetJ2_4: U601.2(CH_1) ; port CH1
NetJ2_5: U601.6(CH_5) ; port CH5
NetJ2_6: U601.5(CH_4) ; port CH4
NetJ2_7: U601.4(CH_3) ; port CH3
NetJ2_8: U601.3(CH_2) ; port CH2

### Notes on the sheet
- (in symbol Title Block_template) Company:; Project:; Variant:; Size:; Page Contents:; Version:; Department:; Author:; Sheet; of; Checked by:; Date:

### Library data of the parts
*#7 = Title Block_template: Standard Title Block; .Creator: GP; Category: Title Block; .PCBcheck: GP; .SCHcheck: GP; Checked by:: =ReviewerName; Size: -
C601 C602 = C100n-10V-1206FNPC-X7R: as C401 on sheet [4] Signals; Supplier 1: Digi-Key; Manufacturer Part Number 1: 885012208009; RoHS: Yes; Category: Ceramic Capacitors; Stock 1: 7198; Pricing 1: 1=0,11000, 10=0,10300, 100=0,09200, 500=0,08100 (USD); Mount: Surface Mount; Case/Package: 1206; Case Code (Metric): 3216; Case Code (Imperial): 1206; Min Operating Temperature: -55°C; Max Operating Temperature: 125°C; Packaging: Tape and Reel; Voltage Rating: 10V; Tolerance: 10%; Length: 0.126inch; Width: 0.063inch; Thickness: 0.035inch; RoHS Compliant: Yes; ComponentLink1URL: http://www.farnell.com/datasheets/2031891.pdf?src-supplier=Farnell; ComponentLink1Description: http://www.farnell.com/datasheets/2031891.pdf?src-supplier=Farnell; ComponentLink2URL: http://katalog.we-online.de/pbs/datasheet/885012208009.pdf?src-supplier=Digi-Key; ComponentLink2Description: http://katalog.we-online.de/pbs/datasheet/885012208009.pdf?src-supplier=Digi-Key; ComponentLink3URL: https://katalog.we-online.de/pbs/datasheet/885012208009.pdf?src-supplier=Digi-Key; ComponentLink3Description: https://katalog.we-online.de/pbs/datasheet/885012208009.pdf?src-supplier=Digi-Key; Supplier Part Number 1: 732-8086-1-ND; ComponentLink4Description: Wurth Elektronik; ComponentLink4URL: https://www.we-online.com/catalog/en/WCAP-CSGP-10VDC?sq=885012208009#885012208009
R601 R602 = R4.7K-1206FTK: Res Thick Film 1206 4.7K Ohm 1% 1/2W ±100ppm/°C Molded SMD T/R; Manufacturer 1: Bourns JW Miller; Voltage Rating: 400V; Power Rating: 500mW; .Creator: AC; Supplier 1: Digi-Key; RoHS: Yes; Category: Chip SMD Resistors; Pricing 1: 1=0,42000, 10=0,35400, 100=0,13850, 1000=0,05796, 2500=0,05313 (USD); Mount: Surface Mount; Case/Package: 1206; Case Code (Metric): 3016; Case Code (Imperial): 1206; Min Operating Temperature: -55°C; Max Operating Temperature: 155°C; Packaging: Cut Tape; Resistor Type: Thick Film; Number of Terminations: 2; Termination: SMD/SMT; Working Voltage: 400V; Voltage Rating (DC): 400V; Tolerance: 1%; Max Power Dissipation: 500mW; Temperature Coefficient: 100ppm/°C; Length: 0.122inch; Width: 0.063inch; Height: 0.026inch; REACH SVHC: No SVHC; ComponentLink1URL: https://datasheet.ciiva.com/48986/70483705-48986735.pdf?src-supplier=Allied+Electronics; ComponentLink1Description: https://datasheet.ciiva.com/48986/70483705-48986735.pdf?src-supplier=Allied+Electronics; Supplier Part Number 1: CRS1206-FX-4701ELFCT-ND; ComponentLink3Description: RS; ComponentLink3URL: https://es.rs-online.com/web/p/resistencias-de-montaje-en-superficie/8672965; Manufacturer Part Number 1: CRS1206-FX-4701ELF
U601 = ADC-LTC1296: 8-Channel Single ADC SAR 46.5ksps 12-bit Serial 20-Pin SOIC W; Manufacturer 1: Analog Devices / Linear Technology; Interface: Serial,Parallel; Sampling Rate: 46500S/s; Resolution: 12b; Supply Type: Dual; Number of Bits: 12; Max Supply Voltage: 12V; Dual Supply Voltage: 5V; Number of Elements: 1; Polarity: Bipolar,Unipolar; Power Dissipation: 500mW; Integral Nonlinearity (INL): 0.75LSB; .Creator: DR; ComponentLink1Description: Datasheet; ComponentLink2Description: Where buy it; Supplier 1: Newark; RoHS: No; Category: Analog to Digital Converters (ADCs); Mount: Surface Mount; Case/Package: SOIC; Number of Pins: 20; Min Operating Temperature: 0°C; Max Operating Temperature: 70°C; Package Quantity: 38; Packaging: Rail/Tube; Operating Supply Voltage: 5V; Lead Free: Contains Lead; RoHS Compliant: No; ComponentLink3URL: https://datasheet.ciiva.com/1250/3526-1250235.pdf?src-supplier=Digi-Key; ComponentLink3Description: https://datasheet.ciiva.com/1250/3526-1250235.pdf?src-supplier=Digi-Key; Supplier Part Number 1: 56M0212

## Nets that join several sheets
+3.3: [1] Supply (5 pins), [5] Accelerometer (12 pins)
+5: main (J1.10), [2] MCU (13 pins), [1] Supply (C101.2 DCDC1.3 R101.2 U101.3), [3] CAN (U301.3), [5] Accelerometer (TXS501.14), [6] ADC (6 pins)
GND: main (J1.9), [2] MCU (24 pins), [1] Supply (10 pins), [3] CAN (10 pins), [4] Signals (27 pins), [5] Accelerometer (15 pins), [6] ADC (7 pins)
APPS1: [2] MCU (U201.19), [4] Signals (C401.2 R401.2 R411.1 TP401.1)
APPS1_s: main (J1.2), [4] Signals (D401.1 R411.2 TP411.1)
APPS2: [2] MCU (U201.20), [4] Signals (C402.2 R402.2 R412.1 TP402.1)
APPS2_s: main (J1.3), [4] Signals (D402.1 R412.2 TP412.1)
AUX1: [2] MCU (U201.26), [4] Signals (C405.2 R405.2 R415.1 TP405.1)
AUX1_s: main (J1.15), [4] Signals (D405.1 R415.2 TP415.1)
AUX2: [2] MCU (U201.27), [4] Signals (C406.2 R406.2 R416.1 TP406.1)
AUX2_s: main (J1.14), [4] Signals (D406.1 R416.2 TP416.1)
AUX3: [2] MCU (U201.14), [4] Signals (C409.2 R419.1 R420.2 TP409.1)
AUX3_s: main (J1.13), [4] Signals (D409.1 R419.2 TP419.1)
Brake: [2] MCU (U201.21), [4] Signals (C403.2 R403.2 R413.1 TP403.1)
Brake_s: main (J1.4), [4] Signals (D403.1 R413.2 TP413.1)
CAN2_ADRX: [2] MCU (U201.11), [3] CAN (TP302.1 U301.4)
CAN2_ADTX: [2] MCU (U201.10), [3] CAN (TP301.1 U301.1)
CAN2_H: main (J1.1), [3] CAN (6 pins)
CAN2_L: main (J1.16), [3] CAN (6 pins)
CS_LTC1296: [2] MCU (U201.36), [6] ADC (R602.1 U601.17)
CSB: [2] MCU (R204.2 R205.2), [5] Accelerometer (S501.18)
LED_CAN2: [2] MCU (U201.5), [3] CAN (R303.2)
LV+in: main (J1.8), [1] Supply (D101.2 D104.A J101.1 TP106.1)
MISO_5V: [2] MCU (R209.1 U201.42), [5] Accelerometer (TXS501.12), [6] ADC (U601.16)
MOSI_5V: [2] MCU (R210.1 U201.43), [5] Accelerometer (TXS501.13), [6] ADC (U601.15)
NetJ2_1: main (J2.1), [6] ADC (U601.7)
NetJ2_2: main (J2.2), [6] ADC (U601.8)
NetJ2_3: main (J2.3), [6] ADC (U601.1)
NetJ2_4: main (J2.4), [6] ADC (U601.2)
NetJ2_5: main (J2.5), [6] ADC (U601.6)
NetJ2_6: main (J2.6), [6] ADC (U601.5)
NetJ2_7: main (J2.7), [6] ADC (U601.4)
NetJ2_8: main (J2.8), [6] ADC (U601.3)
RST: [2] MCU (206.2 R207.2), [5] Accelerometer (S501.3)
SCK_5V: [2] MCU (R208.1 U201.37), [5] Accelerometer (TXS501.11), [6] ADC (U601.18)
SSO_LTC1296: [2] MCU (U201.38), [6] ADC (R601.1 U601.19)
Steering: [2] MCU (U201.22), [4] Signals (C404.2 R404.2 R414.1 TP404.1)
Steering_s: main (J1.5), [4] Signals (D404.1 R414.2 TP414.1)
SuspeFL_s: main (J1.6), [4] Signals (D408.1 R418.2 TP418.1)
SuspeFR_s: main (J1.7), [4] Signals (D407.1 R417.2 TP417.1)
Suspension_FL: [2] MCU (U201.25), [4] Signals (R408.2 R410.1 TP408.1)
Suspension_FR: [2] MCU (U201.24), [4] Signals (R407.2 R409.1 TP407.1)

## Assembly variants
Variant of ADCAN_21_22_Project: not fitted D401 D402 D403 D404 D405 D406 D407 D408 D409 TP401 TP402 TP403 TP404 TP405 TP406 TP407 TP408 TP409 TP411 TP412 TP413 TP414 TP415 TP416 TP417 TP418 TP419